# EAGLE design lightcontrol (EAGLE 9.3.1)

## Sheet 1 of 2
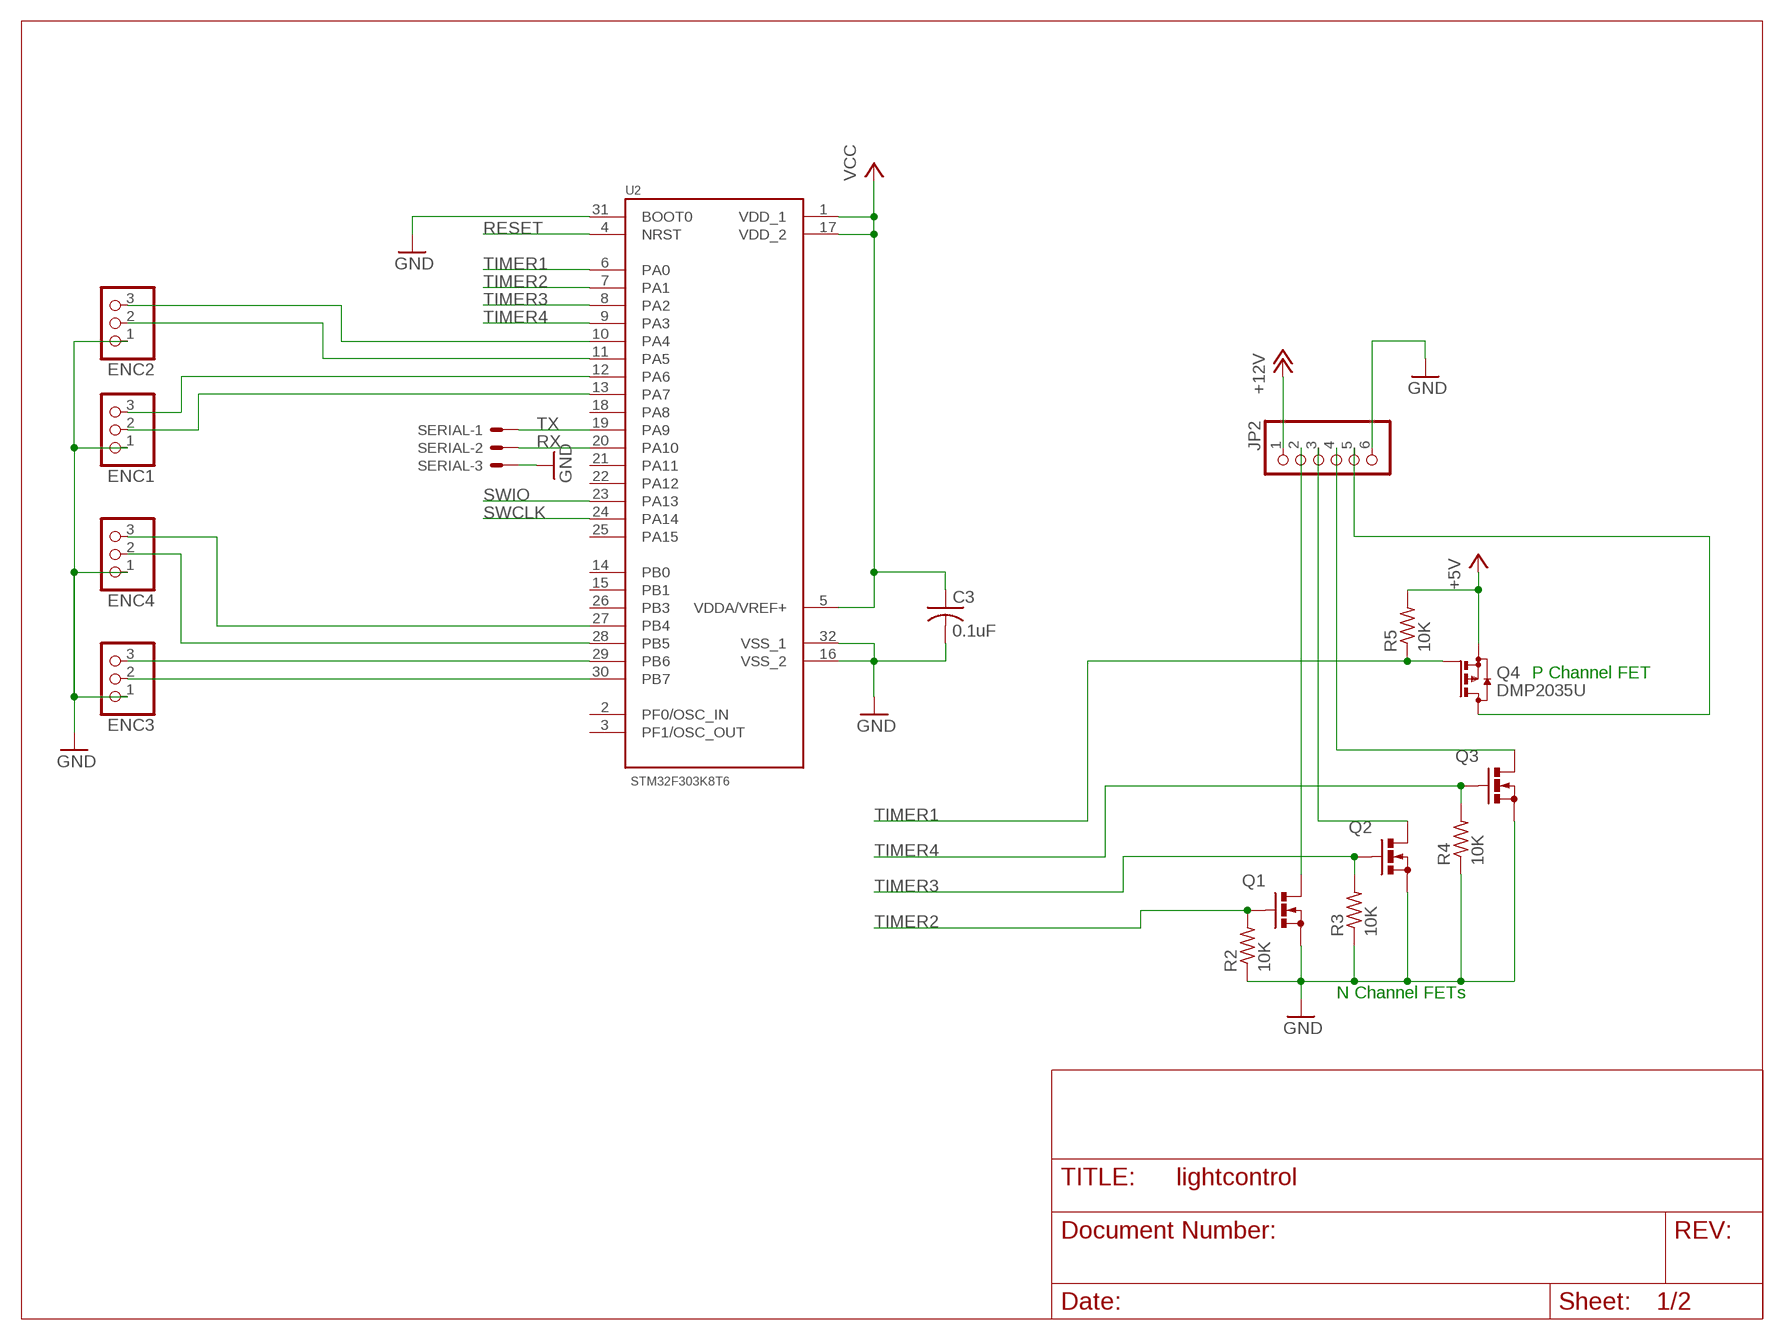
[diagram p0: schematic, sheet 1]

### Parts
C3  0.1uF  C-USC0603  [C0603]
ENC1  PINHD-1X3  [1X03]
ENC2  PINHD-1X3  [1X03]
ENC3  PINHD-1X3  [1X03]
ENC4  PINHD-1X3  [1X03]
JP2  PINHD-1X6/90  [1X06/90]
Q1  BS170  [SOT54E]
Q2  BS170  [SOT54E]
Q3  BS170  [SOT54E]
Q4  DMP2035U  BSS84  [SOT23]
R2  10K  R-US_0204/5  [0204/5]
R3  10K  R-US_0204/5  [0204/5]
R4  10K  R-US_0204/5  [0204/5]
R5  10K  R-US_0204/5  [0204/5]
SERIAL  22-23-2031  [22-23-2031]
U2  STM32F303K8T6  [QFP80P900X900X160-32N]

### Nets
+5V [power]: Q4.2(S) R5.2 ; also sheet 2
+12V [power]: JP2.1 ; also sheet 2
GND: C3.2 ENC1.1 ENC2.1 ENC3.1 ENC4.1 JP2.6 Q1.S Q2.S Q3.S R2.1 R3.1 R4.1 SERIAL.3 U2.16(VSS_2) U2.31(BOOT0) U2.32(VSS_1) ; also sheet 2
N$1: ENC3.2 U2.30(PB7)
N$2: ENC2.3 U2.10(PA4)
N$3: ENC3.3 U2.29(PB6)
N$4: ENC4.2 U2.28(PB5)
N$5 [power]: JP2.2 Q1.D
N$6: ENC2.2 U2.11(PA5)
N$7 [power]: JP2.3 Q2.D
N$8: ENC4.3 U2.27(PB4)
N$11 [power]: JP2.4 Q3.D
N$12 [power]: JP2.5 Q4.3(D)
N$16: ENC1.3 U2.12(PA6)
N$17: ENC1.2 U2.13(PA7)
RESET: U2.4(NRST) ; also sheet 2
RX: SERIAL.2 U2.20(PA10)
SWCLK: U2.24(PA14) ; also sheet 2
SWIO: U2.23(PA13) ; also sheet 2
TIMER1: Q4.1(G) R5.1 U2.6(PA0)
TIMER2: Q1.G R2.2 U2.7(PA1)
TIMER3: Q2.G R3.2 U2.8(PA2)
TIMER4: Q3.G R4.2 U2.9(PA3)
TX: SERIAL.1 U2.19(PA9)
VCC: C3.1 U2.1(VDD_1) U2.5(VDDA/VREF+) U2.17(VDD_2) ; also sheet 2
Unconnected: U2.2(PF0/OSC_IN) U2.3(PF1/OSC_OUT) U2.14(PB0) U2.15(PB1) U2.18(PA8) U2.21(PA11) U2.22(PA12) U2.25(PA15) U2.26(PB3)

### Notes on the sheet
- P Channel FET
- N Channel FETs

## Sheet 2 of 2
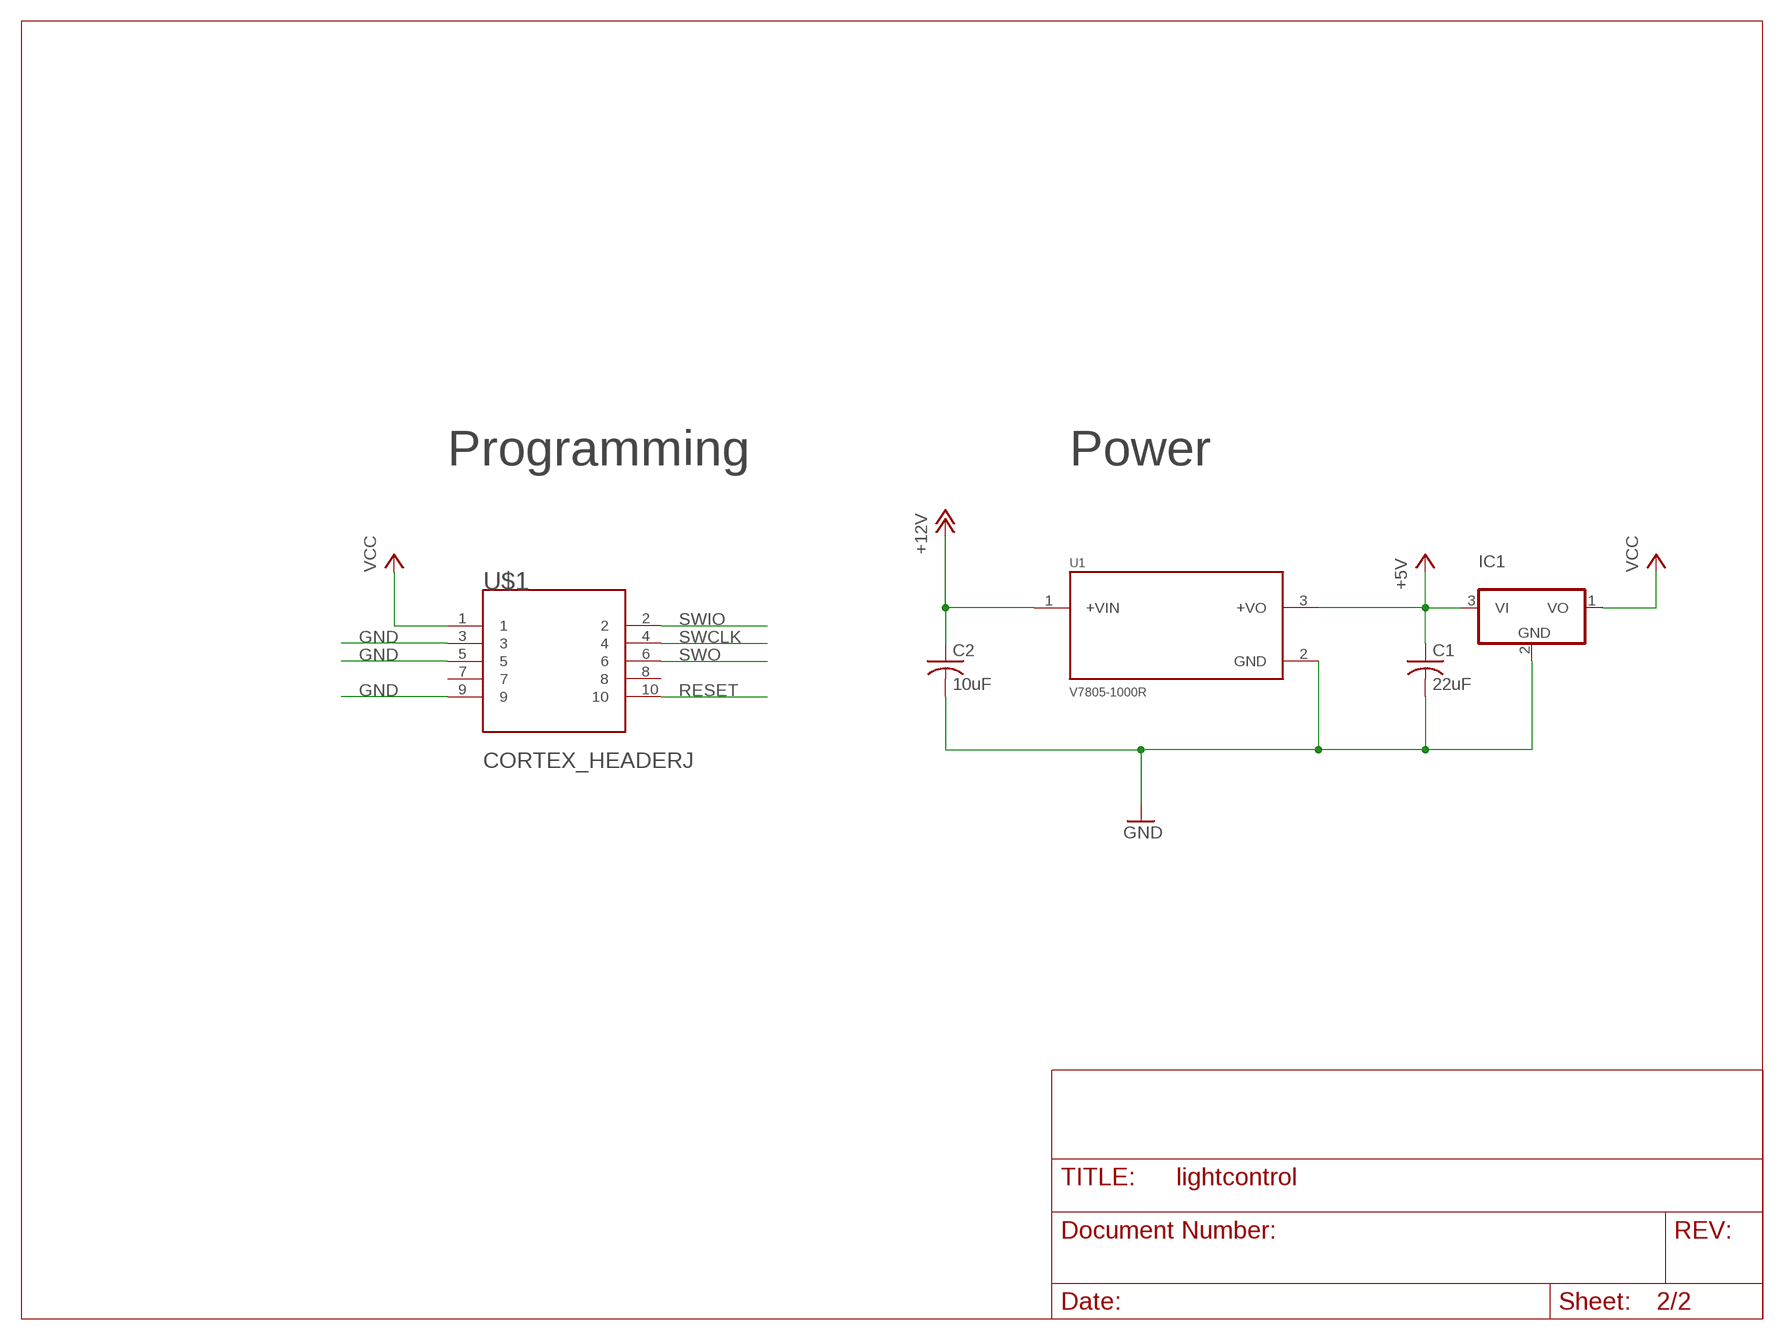
[diagram p1: schematic, sheet 2]

### Parts
C1  22uF  C-US050-035X075  [C050-035X075]
C2  10uF  C-US050-035X075  [C050-035X075]
IC1  7803  78L05Z  [TO92]
U1  V7805-1000R  [CONV_V7805-1000R]
U$1  CORTEX_HEADERJ  [CORTEX_HEADER]

### Nets
+5V [power]: C1.1 IC1.3(VI) U1.3(+VO) ; also sheet 1
+12V [power]: C2.1 U1.1(+VIN) ; also sheet 1
GND: C1.2 C2.2 IC1.2(GND) U1.2(GND) U$1.3 U$1.5 U$1.9 ; also sheet 1
RESET: U$1.10 ; also sheet 1
SWCLK: U$1.4 ; also sheet 1
SWIO: U$1.2 ; also sheet 1
SWO: U$1.6
VCC: IC1.1(VO) U$1.1 ; also sheet 1
Unconnected: U$1.7 U$1.8

### Notes on the sheet
- Programming | Power

## Library data of the parts
C1 C2 = rcl:C-US: CAPACITOR, American symbol
C3 = rcl:C-US: CAPACITOR, American symbol; SPICEPREFIX: C
ENC1-ENC4 = pinhead:PINHD-1X3: PIN HEADER
IC1 = linear:78*: Positive VOLTAGE REGULATOR Source: http://cache.national.com/ds/LM/LM78L05.pdf http://www.fairchildsemi.com/ds/LM/LM7805.pdf
JP2 = pinhead:PINHD-1X6: PIN HEADER
Q1-Q3 = transistor-small-signal:BS170: N-CHANNEL MOS FET
Q4 = transistor-small-signal:BSS84: P-CHANNEL MOS FET
R2-R5 = rcl:R-US_: RESISTOR, American symbol
SERIAL = con-molex:22-23-2031: .100" (2.54mm) Center Header - 3 Pin; MF: MOLEX; MPN: 22-23-2031; OC_FARNELL: 1462950; OC_NEWARK: 30C0862
U1 = V7805-1000R:V7805-1000R: 3.3 Vdc, 1 A, 1.65 W, 4.5~28 Vdc Input Range; CUI_PURCHASE_URL: https://www.cui.com/product/power/dc-dc-converters/non-isolated/v78-1000r-series?utm_source=snapeda.com&utm_medium=referral&utm_campaign=snapedaBOM; DESCRIPTION: V78-1000 Series 5 W Single Output 5 V R/A Non Isolated Switching Regulator-SIP-3; DIGI-KEY_PART_NUMBER: 102-2178-ND; DIGI-KEY_PURCHASE_URL: https://www.digikey.com/product-detail/en/cui-inc/V7805-1000R/102-2178-ND/2352137?utm_source=snapeda&utm_medium=aggregator&utm_campaign=symbol; MF: CUI Inc.; MP: V7805-1000R; PACKAGE: SIP-3 CUI
U2 = STM32F303K8T6:STM32F303K8T6: Analog and DSP with FPU ARM Cortex-M4 MCU with 64 Kbytes Flash, 72 MHz CPU, CCM, 12-bit ADC 5 MSPS, comparators, op-amp; AVAILABILITY: Unavailable; DESCRIPTION: Analog and DSP with FPU ARM Cortex-M4 MCU with 64 Kbytes Flash, 72 MHz CPU, CCM, 12-bit ADC 5 MSPS, comparators, op-amp; MF: STMicroelectronics; MP: STM32F303K8T6; PACKAGE: LQFP-32 STMicroelectronics; PRICE: None
U$1 = Lectrobox:CORTEX_HEADER; AVAILABILITY: Unavailable; DESCRIPTION: Conn Shrouded Header HDR 10 POS 1.27mm Solder ST Thru-Hole Tube; MF: Samtec Inc.; MP: TFM-105-01-S-D-WT; PACKAGE: None; PRICE: None

## Net classes
0 default: width 0.152 mm, drill 0.152 mm, clearance 0.152 mm
1 power: width 0.305 mm, drill 0.305 mm, clearance 0.152 mm to class 0, clearance 0.152 mm

## Board
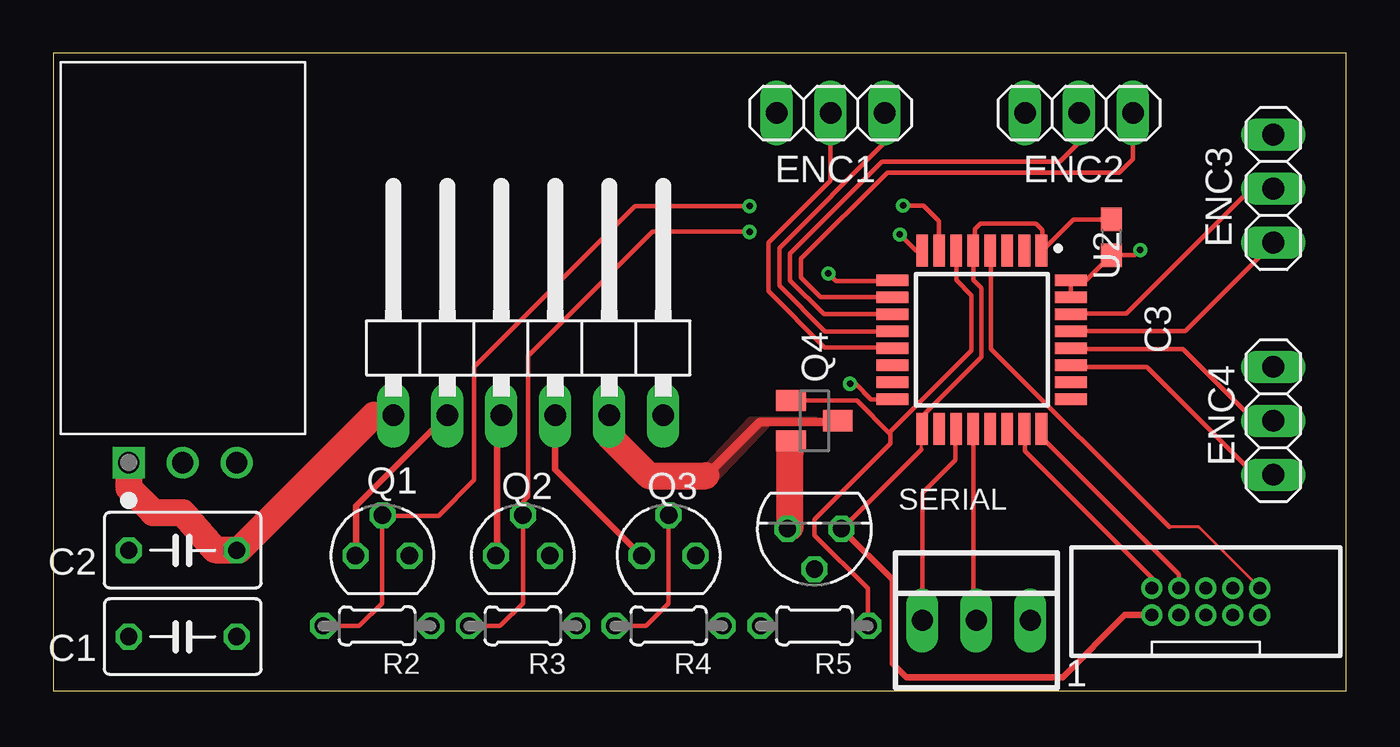
[diagram p2: board, top side]
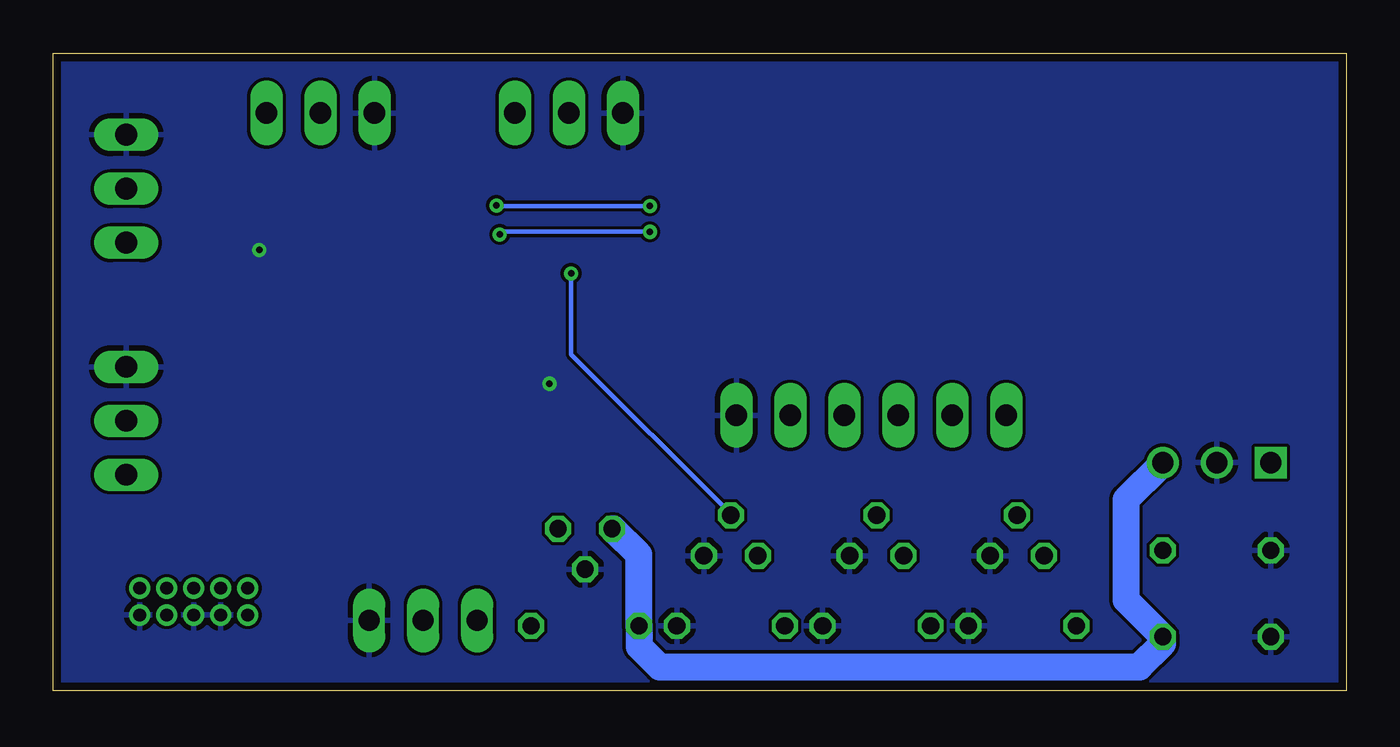
[diagram p3: board, bottom side, seen from below]

Size 60.84 x 30 mm. Coordinates in mm from the lower left corner, seen from the top.
Outline: 0,0 60.84,0 60.84,30 0,30 0,0
Copper layers (1*16): Top 0.0356mm / dielectric 1.5011mm / Bottom 0.0356mm
Design rules "LaenPCBOrder *": minimum track width 6mil, minimum drill 12mil, track to track 6mil, track to pad 6mil, pad to pad 6mil, via to via 6mil, smd to smd 6mil, copper to edge 15mil, drill to drill 6mil, minimum pad ring 7mil, minimum via ring 7mil, stop-mask expansion 3mil, vias tented up to drill 13mil, thermal gap 10mil

### Footprints (pad centres in the part's own frame; a part is rotated, then mirrored left to right if it is on the bottom)
C050-035X075 = drill 0.813 octagon: 1 -2.54,0; 2 2.54,0
C0603 = smd 1.1 x 1: 1 -0.85,0; 2 0.85,0
1X03 = drill 1.016 long: 1 -2.54,0; 2 0,0; 3 2.54,0
TO92 = drill 0.813 octagon: 1 -1.27,0; 2 0,1.905; 3 1.27,0
1X06/90 = drill 1.016 long: 1 -6.35,-3.81; 2 -3.81,-3.81; 3 -1.27,-3.81; 4 1.27,-3.81; 5 3.81,-3.81; 6 6.35,-3.81
SOT54E = drill 0.813 octagon: D -1.27,0; G 0,1.905; S 1.27,0
SOT23 = smd 1 x 1.4: 1 -0.95,-1.1; 2 0.95,-1.1; 3 0,1.1
0204/5 = drill 0.813 octagon: 1 -2.54,0; 2 2.54,0
22-23-2031 = drill 1 long: 1 -2.54,0; 2 0,0; 3 2.54,0
CONV_V7805-1000R = drill 1 square: 1 -10.1,2.54 | drill 1: 2 -10.1,0; 3 -10.1,-2.54
QFP80P900X900X160-32N = smd 1.5 x 0.55: 1 -4.2,2.8; 2 -4.2,2; 3 -4.2,1.2; 4 -4.2,0.4; 5 -4.2,-0.4; 6 -4.2,-1.2; 7 -4.2,-2; 8 -4.2,-2.8; 17 4.2,-2.8; 18 4.2,-2; 19 4.2,-1.2; 20 4.2,-0.4; 21 4.2,0.4; 22 4.2,1.2; 23 4.2,2; 24 4.2,2.8 | smd 0.55 x 1.5: 9 -2.8,-4.2; 10 -2,-4.2; 11 -1.2,-4.2; 12 -0.4,-4.2; 13 0.4,-4.2; 14 1.2,-4.2; 15 2,-4.2; 16 2.8,-4.2; 25 2.8,4.2; 26 2,4.2; 27 1.2,4.2; 28 0.4,4.2; 29 -0.4,4.2; 30 -1.2,4.2; 31 -2,4.2; 32 -2.8,4.2
CORTEX_HEADER = drill 0.6 pad 1: 1 -2.54,-0.635; 2 -2.54,0.635; 3 -1.27,-0.635; 4 -1.27,0.635; 5 0,-0.635; 6 0,0.635; 7 1.27,-0.635; 8 1.27,0.635; 9 2.54,-0.635; 10 2.54,0.635

### Placement (x,y rotation side)
C1  6.1,2.54 180 top
C2  6.1,6.6 180 top
C3  49.78,21.34 270 top
ENC1  36.58,27.18 0 top
ENC2  48.26,27.18 0 top
ENC3  57.4,23.62 270 top
ENC4  57.4,12.7 270 top
IC1  35.81,7.62 180 top
JP2  22.35,16.76 0 top
Q1  15.49,6.35 0 top
Q2  22.1,6.35 0 top
Q3  28.96,6.35 0 top
Q4  35.81,12.7 270 top
R2  15.24,3.05 180 top
R3  22.1,3.05 180 top
R4  28.96,3.05 180 top
R5  35.81,3.05 180 top
SERIAL  43.43,3.3 0 top
U1  6.1,20.83 90 top
U2  43.69,16.51 270 top
U$1  54.23,4.19 0 top

### Tracks (layer width: path | path; a pad name or v marks a point on that pad's centre or on a via)
+5V
  Top 0.305: 34.67,11.23 34.55,11.58 Q4.2 | 34.67,7.7 IC1.3
  Top 1.27: 34.67,7.7 34.67,11.23
  Bottom 0.305: 8.69,10.67 U1.3 | 34.52,7.62 IC1.3
  Bottom 0.813: C1.1 8.64,2.21
  Bottom 1.27: C1.1 10.36,4.27 10.36,8.99 8.69,10.67 | 34.52,7.62 33.3,6.4 33.3,3.05 R5.2 33.27,2.08 32.31,1.12 9.73,1.12 8.64,2.21
+12V
  Top 0.305: 8.61,6.63 C2.1 | 3.58,10.67 U1.1
  Top 1.016: 15.09,12.95 JP2.1 | 8.76,6.63 C2.1
  Top 1.27: 8.61,6.63 7.62,6.63 6.1,8.38 4.7,8.38 3.56,9.53 3.56,10.64 3.58,10.67 | 8.76,6.63 15.09,12.95
GND  (via drill 0.3)
  Top 0.152: U2.32 48.61,19.31
  Top 0.203: U2.31 U2.32 | 48.61,19.31 C3.2 50.89,20.49 v51.14,20.74 | U2.16 38.48,13.71 37.75,14.44 v37.5,14.44
  pour Bottom: 0,29.97 60.96,29.97 60.96,0 0,0
N$1
  Top 0.152: 47.93,17.75 U2.30 | 56.36,23.62 ENC3.2
  Top 0.203: 47.93,17.75 50.49,17.75 56.36,23.62
N$2
  Top 0.152: 39.47,18.52 U2.10
  Top 0.203: ENC2.3 50.8,25.02 50.16,24.38 39.24,24.38 35.18,20.32 35.18,19.43 36.09,18.52 39.47,18.52
N$3
  Top 0.152: 47.93,16.92 U2.29 | 57.38,21.03 ENC3.3
  Top 0.203: 47.93,16.92 53.26,16.92 57.38,21.03
N$4
  Top 0.152: 47.93,16.08 U2.28 | 57.38,12.72 ENC4.2
  Top 0.203: 47.93,16.08 53.14,16.08 56.49,12.72 57.38,12.72
N$5
  Top 0.305: Q1.D 14.25,6.4 14.25,8.69 18.52,12.95 JP2.2
N$6
  Top 0.203: ENC2.2 48.26,25.78 47.37,24.89 38.99,24.89 34.67,20.57 34.67,19.3 36.27,17.71 U2.11
N$7
  Top 0.305: Q2.D 20.88,6.4 20.88,12.8 21.03,12.95 JP2.3
N$8
  Top 0.152: 47.93,15.24 U2.27
  Top 0.203: 47.93,15.24 51.46,15.24 56.54,10.16 ENC4.3
N$11
  Top 0.305: Q3.D 23.62,10.41 JP2.4
N$12
  Top 0.305: 36.88,12.65 Q4.3
  Top 0.406: 36.88,12.65 33.25,12.65 30.71,10.11
  Top 1.27: 30.71,10.11 28.04,10.11 26.16,11.99 JP2.5
  pour Top: 30.73,10.67 32.77,12.83 36.83,12.83 arc-45 36.34,12.57 33.78,12.57 30.99,9.65
N$16
  Top 0.203: ENC1.3 39.12,25.78 34.16,20.83 34.16,19.05 36.3,16.91 U2.12
N$17
  Top 0.152: 39.47,16.15 U2.13
  Top 0.203: ENC1.2 36.58,24 33.66,21.08 33.66,18.8 36.3,16.15 39.47,16.15
RESET
  Top 0.152: 52.5,7.7 53.9,7.7 U$1.10 | 44.12,20.65 U2.4
  Top 0.203: 44.12,20.65 44.12,16.08 52.5,7.7
RX
  Top 0.152: 43.36,12.27 U2.20
  Top 0.203: U2.20 43.29,3.45 SERIAL.2
SWCLK
  Top 0.152: 46.56,11.86 46.56,12.27 U2.24
  Top 0.203: U$1.4 52.96,5.46 46.56,11.86
SWIO
  Top 0.152: 45.72,12.27 U2.23 | 51.69,5.31 U$1.2
  Top 0.203: 45.72,12.27 45.72,11.28 51.69,5.31
TIMER1
  Top 0.152: 38.33,3.05 R5.1
  Top 0.203: 38.33,3.05 38.33,4.8 35.81,7.32 35.81,8.05 39.4,11.63 39.4,12.06 | U2.6 42.49,19.31 43.2,18.6 43.2,16.02 39.4,12.21 39.4,12.06 | Q4.1 37.81,13.65 39.4,12.06
TIMER2  (via drill 0.3)
  Top 0.152: 41.68,20.73 U2.7 | 15.47,8.23 Q1.G
  Top 0.203: 41.68,20.73 41.68,22.1 40.95,22.84 v39.98,22.84 | R2.2 14.4,3.05 15.47,4.12 15.47,8.23 18.14,8.23 19.81,9.91 19.81,15.24 27.38,22.81 v32.77,22.81
  Bottom 0.152: 39.73,22.84 39.91,22.84 39.88,22.81
  Bottom 0.203: v39.98,22.84 39.73,22.84 | v32.77,22.81 39.88,22.81
TIMER3  (via drill 0.3)
  Top 0.152: 22.1,8.89 Q2.G 22.1,8.23
  Top 0.203: U2.8 40.58,20.71 v39.83,21.46 | R3.2 21.03,3.05 22.1,4.12 22.1,8.23 | 22.1,8.89 22.35,9.14 22.35,15.75 28.19,21.59 v32.77,21.59
  Bottom 0.152: v39.83,21.46 39.7,21.59
  Bottom 0.203: 39.7,21.59 v32.77,21.59
TIMER4  (via drill 0.3)
  Top 0.152: 28.96,8.23 Q3.G | 39.4,19.28 U2.9
  Top 0.203: R4.2 27.89,3.05 28.96,4.12 28.96,8.23 | 39.4,19.28 36.83,19.28 v36.47,19.63
  Bottom 0.152: 28.96,8.31 Q3.G
  Bottom 0.203: v36.47,19.63 36.47,15.82 28.96,8.31
TX
  Top 0.152: 42.44,12.27 U2.19
  Top 0.203: 42.44,12.27 42.44,10.85 40.89,9.3 SERIAL.1
VCC
  Top 0.152: 49.76,22.17 C3.1 | U2.1 46.56,20.73 46.7,20.87 46.53,21.03 | 43.36,20.73 U2.5 | 40.84,11.35 40.84,12.27 U2.17 40.92,12.34 40.92,12.95 | 37.11,7.62 IC1.1
  Top 0.203: 49.76,22.17 48.01,22.17 46.83,20.99 46.7,20.87 | 43.36,20.73 43.36,21.72 43.61,21.97 46.23,21.97 46.53,21.67 46.53,21.03 | 37.11,7.62 40.84,11.35 | U2.5 43.29,19.31 43.66,18.94 43.66,15.7 40.92,12.95
  Top 0.305: U$1.1 50.42,3.56 47.5,0.64 40.13,0.64 39.5,1.27 39.5,5.21 IC1.1

### Text on the board
tDocu: 1 | Lectrobox DIODER Controller++ / Rev B March 2019 | 1 | 1 | 1 | 1 | TX RX GND